# Altium schematic sheet MAX2014.SchDoc
size A
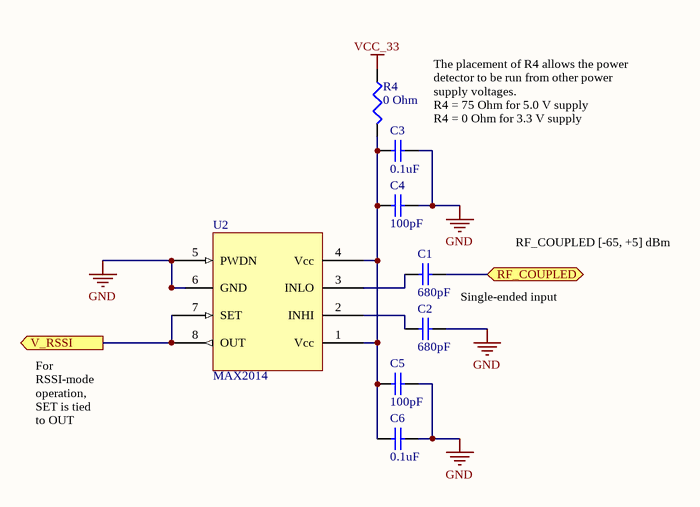
[diagram p0: MAX2014.SchDoc]

## Parts
C1  value 680pF  [1608[0603]]  (hidden comment: Cap Semi)
C2  value 680pF  [1608[0603]]  (hidden comment: Cap Semi)
C3  value 0.1uF  [1608[0603]]  (hidden comment: Cap Semi)
C4  value 100pF  [1608[0603]]  (hidden comment: Cap Semi)
C5  value 100pF  [1608[0603]]  (hidden comment: Cap Semi)
C6  value 0.1uF  [1608[0603]]  (hidden comment: Cap Semi)
R4  value 0 Ohm  [0805_SMT]  (hidden comment: Res3)
U2  MAX2014  [uMAX-8]

## Ports
RF_COUPLED, V_RSSI (out)

## Nets
GND: C2.2 C3.1 C4.1 C5.1 C6.1 U2.5(PWDN) U2.6(GND)
VCC_33: R4.1
RF_COUPLED: C1.2 ; port RF_COUPLED
V_RSSI: U2.7(SET) U2.8(OUT) ; port V_RSSI
NetC1_1: C1.1 U2.3(INLO)
NetC2_1: C2.1 U2.2(INHI)
NetC3_2: C3.2 C4.2 C5.2 C6.2 R4.2 U2.1(Vcc) U2.4(Vcc)

## Notes on the sheet
- (near C3) The placement of R4 allows the power detector to be run from other power supply voltages.
  R4 = 75 Ohm for 5.0 V supply
  R4 = 0 Ohm for 3.3 V supply
- RF_COUPLED [-65, +5] dBm
- Single-ended input
- For RSSI-mode operation, SET is tied to OUT

## Library data of the parts
C1-C6 = Cap Semi: Capacitor (Semiconductor SIM Model); Published: 8-Jun-2000; LatestRevisionDate: 29-May-2009; LatestRevisionNote: IPC-7351 Footprint Added.; PackageReference: C1206; Publisher: Altium Limited; PackageDescription: Chip Capacitor
R4 = Res3: Resistor; Published: 8-Jun-2000; LatestRevisionDate: 29-May-2009; LatestRevisionNote: IPC-7351 Footprint Added.; PackageReference: J1-0603; Publisher: Altium Limited; PackageDescription: Chip Resistor